# EAGLE design reprap_modular_electronics_master (EAGLE 5.11)
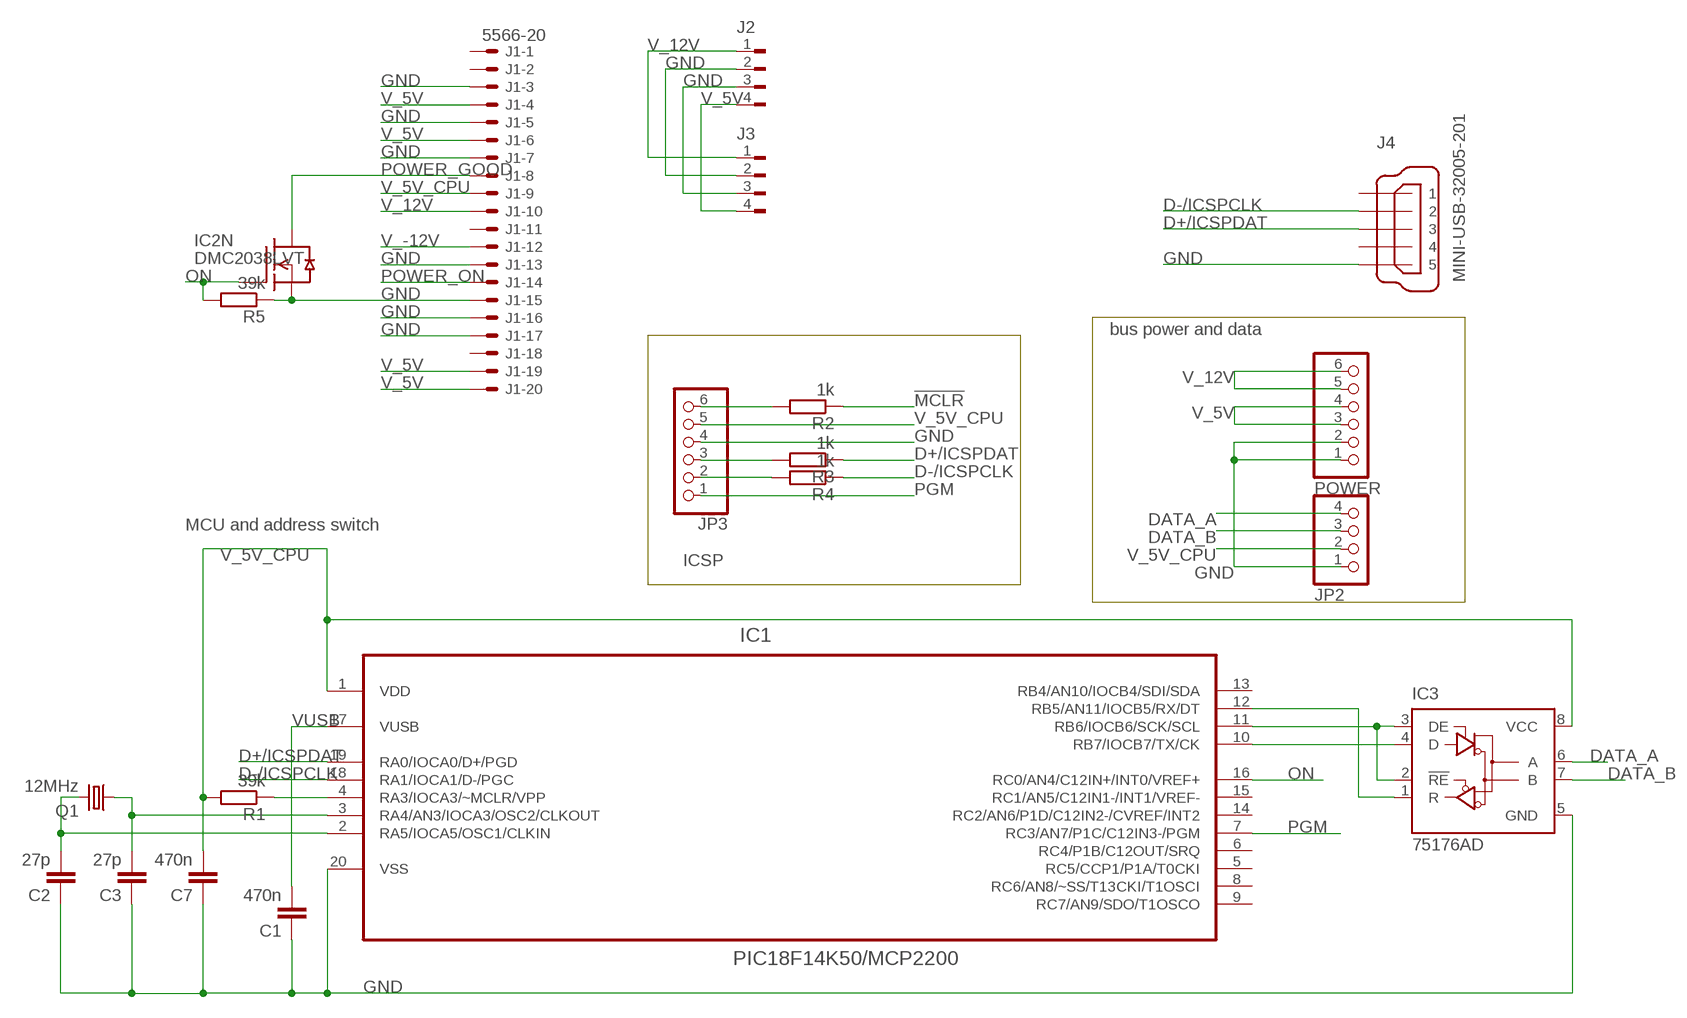
[diagram p0: schematic, sheet 1]

## Parts
C1  470n  C-EUC0603K  [C0603K]
C2  27p  C-EUC0603K  [C0603K]
C3  27p  C-EUC0603K  [C0603K]
C7  470n  C-EUC0603K  [C0603K]
IC1  PIC18F14K50/MCP2200  PIC18F14K50-I/SO  [SOIC127P1030X265-20N]
IC2  DMC2038LVT  [SOT23-6]
IC3  75176AD  [D_R-PDSO-G8]
J1  5566-20  [5566-20]
J2  FLOPPY-4  [FLOPPY-4]
J3  FLOPPY-4  [FLOPPY-4]
J4  MINI-USB-32005-201  [32005-201]
JP2  PINHD-1X4/90  [1X04/90]
JP3  PINHD-1X6/90  [1X06/90]
POWER  PINHD-1X6/90  [1X06/90]
Q1  12MHz  CRYSTALCTS406  [CTS406]
R1  39k  R-EU_R0603  [R0603]
R2  1k  R-EU_R0603  [R0603]
R3  1k  R-EU_R0603  [R0603]
R4  1k  R-EU_R0603  [R0603]
R5  39k  R-EU_R0603  [R0603]

## Nets
!MCLR: IC1.4(RA3/IOCA3/~MCLR/VPP) R1.1 R2.1
D+/ICSPDAT: IC1.19(RA0/IOCA0/D+/PGD) J4.3 R3.1
D-/ICSPCLK: IC1.18(RA1/IOCA1/D-/PGC) J4.2 R4.1
DATA_A: IC3.6(A) JP2.4
DATA_B: IC3.7(B) JP2.3
GND: C1.1 C2.1 C3.1 C7.1 IC1.20(VSS) IC2.5(N:S) IC3.5(GND) J1.3 J1.5 J1.7 J1.13 J1.15 J1.16 J1.17 J2.2 J2.3 J3.2 J3.3 J4.5 JP2.1 JP3.4 POWER.1 POWER.2 R5.1
N$1: C2.2 IC1.2(RA5/IOCA5/OSC1/CLKIN) Q1.3
N$2: C3.2 IC1.3(RA4/AN3/IOCA3/OSC2/CLKOUT) Q1.1
N$3: IC1.12(RB5/AN11/IOCB5/RX/DT) IC3.1(R)
N$4: JP3.3 R3.2
N$5: JP3.2 R4.2
N$6: JP3.6 R2.2
N$7: IC1.11(RB6/IOCB6/SCK/SCL) IC3.2(!RE) IC3.3(DE)
N$8: IC1.10(RB7/IOCB7/TX/CK) IC3.4(D)
ON: IC1.16(RC0/AN4/C12IN+/INT0/VREF+) IC2.1(N:G) R5.2
PGM: IC1.7(RC3/AN7/P1C/C12IN3-/PGM) JP3.1
POWER_GOOD: IC2.6(N:D) J1.8
POWER_ON: J1.14
V_5V: J1.4 J1.6 J1.19 J1.20 J2.4 J3.4 POWER.3 POWER.4
V_5V_CPU: C7.2 IC1.1(VDD) IC3.8(VCC) J1.9 JP2.2 JP3.5 R1.2
V_12V: J1.10 J2.1 J3.1 POWER.5 POWER.6
V_-12V: J1.12
VUSB: C1.2 IC1.17(VUSB)
Unconnected: IC1.5(RC5/CCP1/P1A/T0CKI) IC1.6(RC4/P1B/C12OUT/SRQ) IC1.8(RC6/AN8/~SS/T13CKI/T1OSCI) IC1.9(RC7/AN9/SDO/T1OSCO) IC1.13(RB4/AN10/IOCB4/SDI/SDA) IC1.14(RC2/AN6/P1D/C12IN2-/CVREF/INT2) IC2.2(P:S) IC2.3(P:G) IC2.4(P:D) J1.1 J1.2 J1.11 J1.18 J4.1 J4.4

## Notes on the sheet
- bus power and data
- MCU and address switch
- ICSP

## Power pins joined to a net without a drawn wire
RC1/AN5/C12IN1-/INT1/VREF-: IC1.15(RC1/AN5/C12IN1-/INT1/VREF-)

## Library data of the parts
C1-C3 C7 = rcl:C-EU: CAPACITOR, European symbol
IC1 = ics:PIC18F14K50-I/SO: USB Flash Microcontrollers; DESCRIPTION: Microcontrollers; MPN: PIC18F14K50-I/SO; OC_FARNELL: 1648502; OC_NEWARK: 77M3104; PACKAGE: SOIC-20; SUPPLIER: Microchip
IC2 = ics:DMC2038LVT
IC3 = 751xx:75176A: DIFFERENTIAL BUS TRANSCEIVER Source: http://focus.ti.com/lit/ds/symlink/sn75176a.pdf
J1 = con-molex:5566-20: Mini FIT connector 20 pol ATX PC-Motherboard Power connector Source: http://www.molex.com; OC_FARNELL: unknown; OC_NEWARK: unknown
J2 J3 = con-amp:FLOPPY-4: MATE N-LOCK Floppy / HDD conector Distributor: Bürklin 71F970; OC_FARNELL: unknown; OC_NEWARK: unknown
J4 = con-cypressindustries:MINI-USB-: MINI USB-B Conector Source: www.cypressindustries.com; OC_FARNELL: unknown; OC_NEWARK: unknown
JP2 = pinhead:PINHD-1X4: PIN HEADER
JP3 POWER = pinhead:PINHD-1X6: PIN HEADER
Q1 = crystal:CRYSTAL: CRYSTAL; OC_FARNELL: unknown; OC_NEWARK: unknown
R1-R5 = rcl:R-EU_: RESISTOR, European symbol

## Board
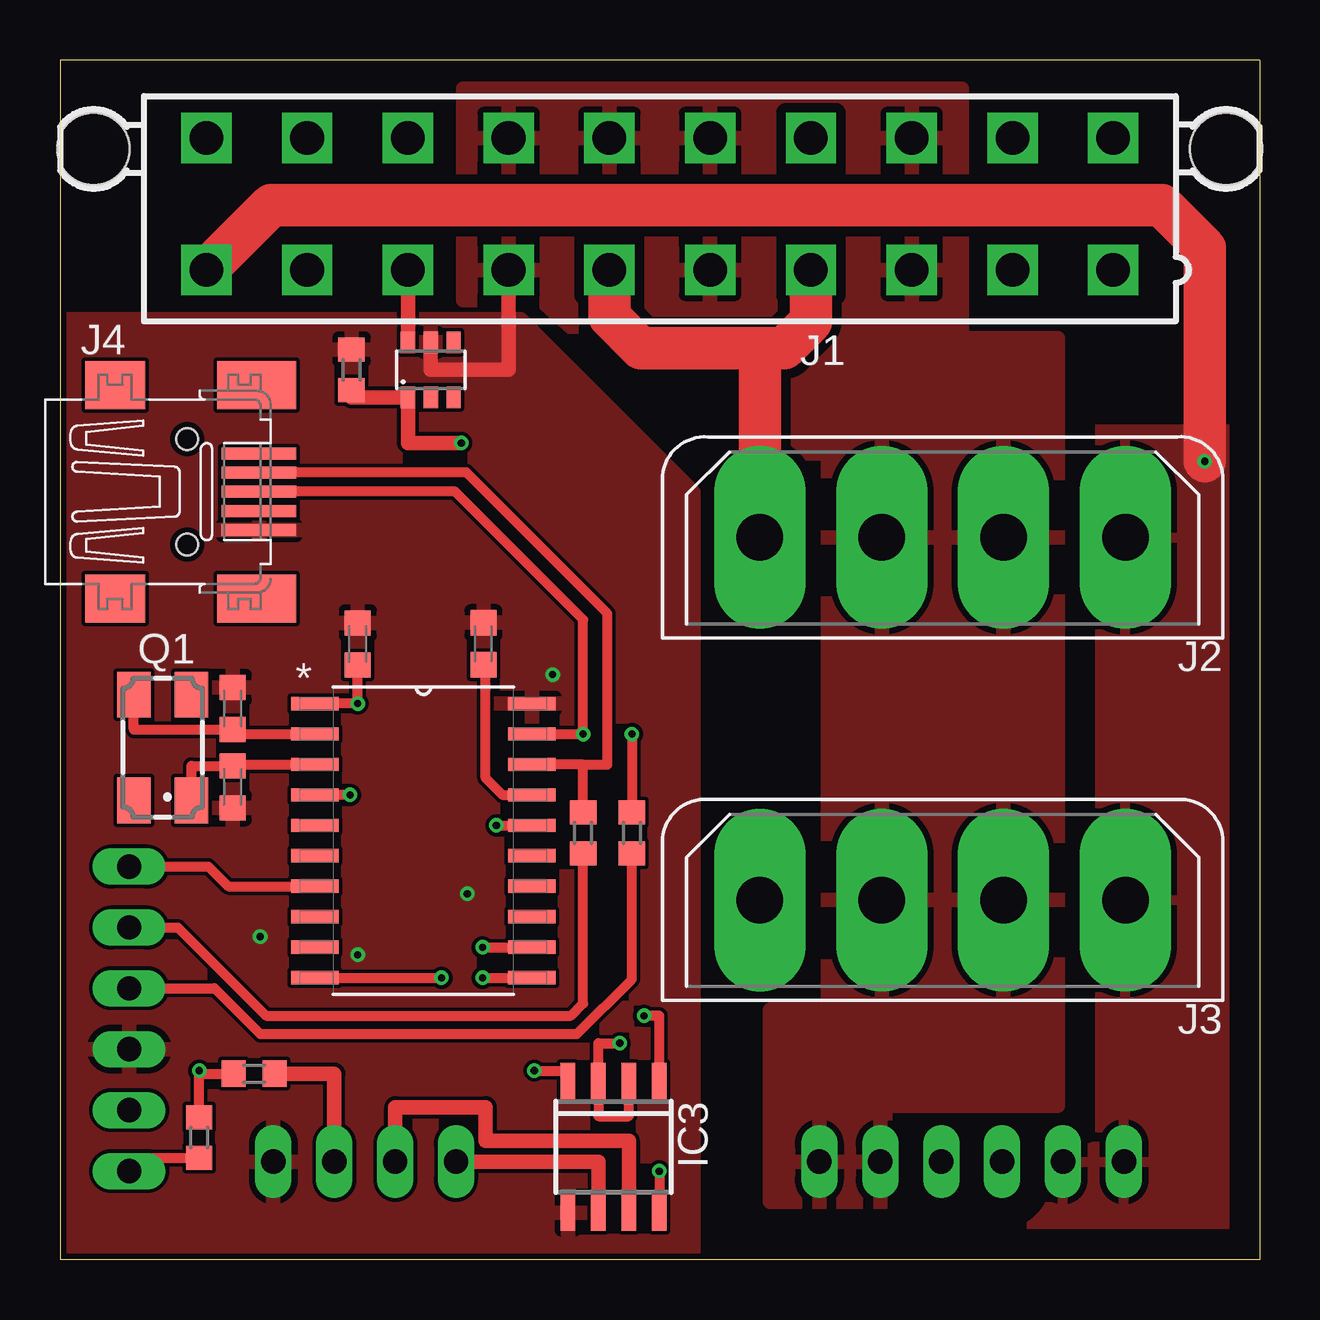
[diagram p1: board, top side]
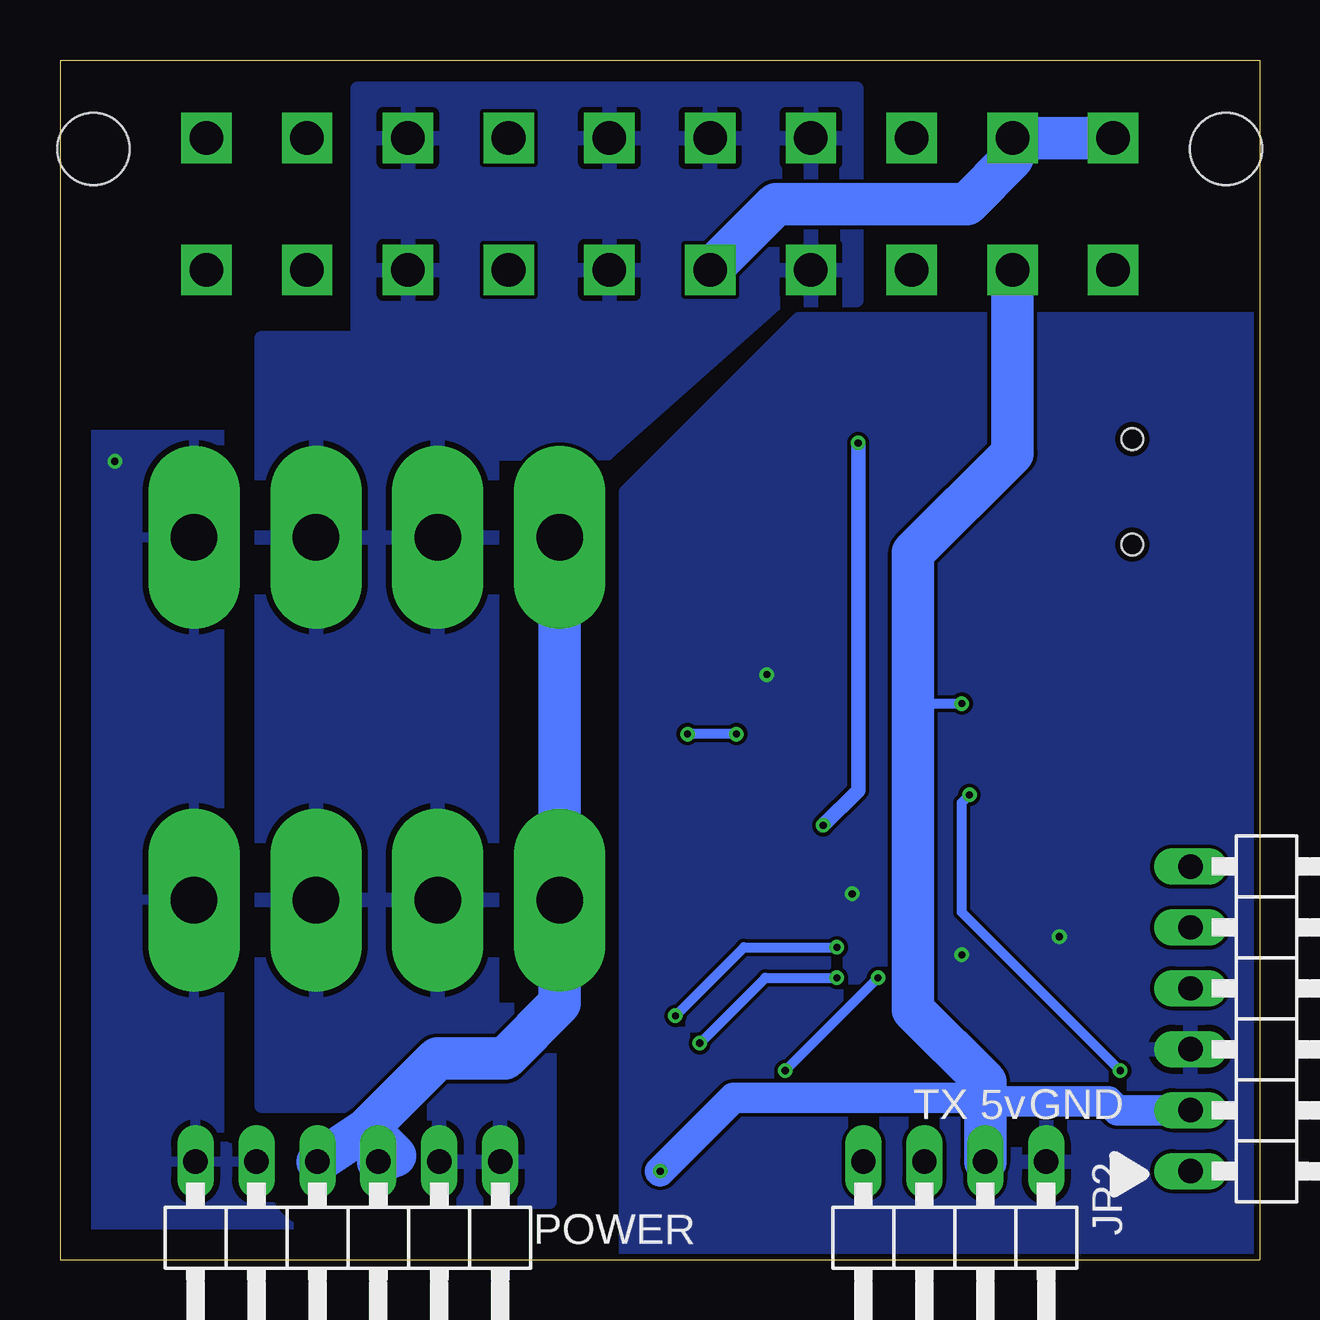
[diagram p2: board, bottom side, seen from below]

Size 50 x 50 mm. Coordinates in mm from the lower left corner, seen from the top.
Outline: 50,0 0,0 0,50 50,50 50,0
Copper layers (1*16): Top 0.035mm / dielectric 1.5mm / Bottom 0.035mm
Design rules "ITead_rule": minimum track width 6mil, minimum drill 0.3mm, track to track 6mil, track to pad 6mil, pad to pad 6mil, via to via 6mil, smd to smd 0mil, copper to edge 10mil, drill to drill 10mil, minimum pad ring 10mil, minimum via ring 6mil, stop-mask expansion 2mil, vias tented up to drill 100mil, thermal gap 10mil

### Footprints (pad centres in the part's own frame; a part is rotated, then mirrored left to right if it is on the bottom)
C0603K = smd 1.05 x 1.08: 1 -0.875,0; 2 0.875,0
SOIC127P1030X265-20N = smd 1.981 x 0.559: 1 -4.521,5.715; 2 -4.521,4.445; 3 -4.521,3.175; 4 -4.521,1.905; 5 -4.521,0.635; 6 -4.521,-0.635; 7 -4.521,-1.905; 8 -4.521,-3.175; 9 -4.521,-4.445; 10 -4.521,-5.715; 11 4.521,-5.715; 12 4.521,-4.445; 13 4.521,-3.175; 14 4.521,-1.905; 15 4.521,-0.635; 16 4.521,0.635; 17 4.521,1.905; 18 4.521,3.175; 19 4.521,4.445; 20 4.521,5.715
SOT23-6 = smd 0.6 x 0.9: 1 -0.95,-1.15; 2 0,-1.15; 3 0.95,-1.15; 4 0.95,1.15; 5 0,1.15; 6 -0.95,1.15
D_R-PDSO-G8 = smd 0.6 x 1.5: 1 -1.905,-2.75; 2 -0.635,-2.75; 3 0.635,-2.75; 4 1.905,-2.75; 5 1.905,2.75; 6 0.635,2.75; 7 -0.635,2.75; 8 -1.905,2.75
5566-20 = drill 1.4 square: 1 18.9,-2.75; 2 14.7,-2.75; 3 10.5,-2.75; 4 6.3,-2.75; 5 2.1,-2.75; 6 -2.1,-2.75; 7 -6.3,-2.75; 8 -10.5,-2.75; 9 -14.7,-2.75; 10 -18.9,-2.75; 11 18.9,2.75; 12 14.7,2.75; 13 10.5,2.75; 14 6.3,2.75; 15 2.1,2.75; 16 -2.1,2.75; 17 -6.3,2.75; 18 -10.5,2.75; 19 -14.7,2.75; 20 -18.9,2.75 | hole 3: 23.6,2.29; -23.6,2.29
FLOPPY-4 = drill 1.93 pad 3.81 long: 1 7.62,0; 2 2.54,0; 3 -2.54,0; 4 -7.62,0
32005-201 = smd 3.1 x 0.5: 1 3,1.6; 2 3,0.8; 3 3,0; 4 3,-0.8; 5 3,-1.6 | smd 2.5 x 2: M1 -3,-4.45; M2 -3,4.45 | smd 3.3 x 2: M3 2.9,4.45; M4 2.9,-4.45 | hole 0.9: 0,2.2; 0,-2.2
1X04/90 = drill 1.016 long: 1 -3.81,-3.81; 2 -1.27,-3.81; 3 1.27,-3.81; 4 3.81,-3.81
1X06/90 = drill 1.016 long: 1 -6.35,-3.81; 2 -3.81,-3.81; 3 -1.27,-3.81; 4 1.27,-3.81; 5 3.81,-3.81; 6 6.35,-3.81
CTS406 = smd 1.9 x 1.4: 1 -2.2,-1.2; 2 2.2,-1.2; 3 2.2,1.2; 4 -2.2,1.2
R0603 = smd 1 x 1.1: 1 -0.85,0; 2 0.85,0

### Placement (x,y rotation side)
C1  17.65,25.67 270 top
C2  7.2,22.97 270 top
C3  7.2,19.7 90 top
C7  12.41,25.65 270 top
IC1  15.15,17.46 0 top
IC2  15.46,37.08 0 top
IC3  23.08,4.7 180 top
J1  25,44 0 top
J2  36.79,30.1 0 top
J3  36.79,14.99 0 top
J4  5.3,32 0 top
JP2  12.7,0.27 180 bottom
JP3  -0.93,10.03 270 bottom
POWER  38,0.27 180 bottom
Q1  4.28,21.34 90 top
R1  8.09,7.75 0 top
R2  5.8,5.08 270 top
R3  23.84,17.78 270 top
R4  21.81,17.78 270 top
R5  12.15,37.08 270 top

### Tracks (layer width: path | path; a pad name or v marks a point on that pad's centre or on a via)
!MCLR  (via drill 0.3)
  Top 0.406: 5.8,7.75 R1.1 | R2.1 5.8,7.75 | v12.09,19.36 IC1.4 | 5.8,7.75 v5.8,7.87
  Bottom 0.406: v12.09,19.36 12.41,19.05 12.41,14.48 v5.8,7.87
D+/ICSPDAT  (via drill 0.3)
  Top 0.406: IC1.19 v21.81,21.91 21.81,26.67 16.47,32 J4.3 | v23.84,21.91 R3.1
  Bottom 0.406: v21.81,21.91 v23.84,21.91
D-/ICSPCLK
  Top 0.406: 21.81,20.64 22.82,20.64 22.82,26.92 16.94,32.8 J4.2 | 21.81,20.64 IC1.18 | R4.1 21.81,20.64
DATA_A
  Top 0.61: IC3.6 22.44,4.06 16.51,4.06 JP2.4
DATA_B
  Top 0.61: IC3.7 23.71,4.95 17.74,4.95 17.74,6.35 13.97,6.35 JP2.3
GND  (via drill 0.3)
  Top 0.61: IC2.5 15.46,37.08 18.7,37.08 J1.7
  other vias: 20.54,24.38 12.41,12.7 8.34,13.46 16.98,15.24
  pour Top (isolate 0.406): 16.8,48.8 16.8,40 20,40 27.2,33.6 32,33.6 32,10.4 29.6,10.4 29.6,2.4 34.4,2.4 34.4,6.4 41.6,6.4 41.6,38.4 37.6,38.4 37.6,48.8
  pour Bottom: 16.8,48.8 16.8,40 20,40 27.2,33.6 32,33.6 32,10.4 29.6,10.4 29.6,2.4 34.4,2.4 34.4,6.4 41.6,6.4 41.6,38.4 37.6,38.4 37.6,48.8
  pour Top: 0,0 26.4,0 26.4,32 19.2,39.2 0,39.2
  pour Bottom: 0,0 26.4,0 26.4,32 19.2,39.2 0,39.2
N$1
  Top 0.406: Q1.3 3.08,22.09 C2.2 7.2,21.91 IC1.2
N$2
  Top 0.406: Q1.1 5.48,20.58 C3.2 7.2,20.64 IC1.3
N$3  (via drill 0.3)
  Top 0.406: IC3.1 24.98,10.16 v24.35,10.16 | v17.61,13.02 IC1.12
  Bottom 0.406: v24.35,10.16 21.49,13.02 v17.61,13.02
N$4
  Top 0.406: JP3.3 6.44,11.3 8.34,9.4 21.55,9.4 23.84,11.68 R3.2
N$5
  Top 0.406: JP3.2 4.92,13.84 8.6,10.16 21.3,10.16 21.81,10.67 R4.2
N$6
  Top 0.406: JP3.6 2.88,4.23 R2.2
N$7  (via drill 0.3)
  Top 0.406: IC3.2 23.71,5.97 22.44,5.97 IC3.3 22.44,9.02 v23.33,9.02 | v17.61,11.74 IC1.11
  Bottom 0.406: v23.33,9.02 20.6,11.74 v17.61,11.74
N$8  (via drill 0.3)
  Top 0.406: IC3.4 21.17,7.87 v19.77,7.87 | IC1.10 v15.9,11.74
  Bottom 0.406: v15.9,11.74 v19.77,7.87
ON  (via drill 0.3)
  Top 0.406: v18.19,18.09 IC1.16
  Top 0.61: R5.2 12.15,35.93 IC2.1 14.51,34.04 v16.73,34.04
  Bottom 0.61: v16.73,34.04 16.73,19.56 v18.19,18.09
PGM
  Top 0.406: JP3.1 6.18,16.38 7.01,15.55 IC1.7
POWER_GOOD
  Top 0.61: J1.8 IC2.6
V_5V
  Top 1.778: J1.4 31.3,39.1 30.2,38 29.2,38 | J1.6 22.9,39.3 24.2,38 29.2,38 | J2.4 29.17,37.97 29.2,38
  Bottom 1.778: J2.4 J3.4 29.17,10.67 31.46,8.38 34.27,8.38 37.18,5.47 | 37.18,5.47 POWER.4 | POWER.3 36.03,4.32 37.18,5.47 | J1.20 J1.19 10.3,45.9 12.2,44 20.15,44 J1.6
V_5V_CPU  (via drill 0.3)
  Top 0.406: IC1.1 v12.41,23.18 C7.2 | v24.98,3.68 IC3.8
  Top 0.61: R1.2 11.43,7.75 JP2.2
  Bottom 0.406: v12.41,23.18 14.69,23.18 14.44,23.37
  Bottom 1.27: JP3.5 5.93,6.22 6.31,6.6 11.43,6.6 11.43,6.73 21.93,6.73 v24.98,3.68
  Bottom 1.778: J1.9 10.3,33.6 14.44,29.46 14.44,23.37 14.44,10.41 11.43,7.4 11.43,6.73 JP2.2
V_12V  (via drill 0.3)
  Top 1.778: J1.10 8.79,43.94 45.94,43.94 47.71,42.16 v47.71,33.27
  pour Top (isolate 1.27, rank 2): 42.07,34.62 49.87,34.62 50,0 40.2,0 40.2,10 42.2,12
  pour Bottom (isolate 1.27, rank 2): 42.2,34.36 50,34.36 50,0 40.2,0 40.2,10 42.2,12
VUSB
  Top 0.406: IC1.17 18.44,19.36 17.74,20.07 17.74,24.79 C1.2

### Text on the board
bNames: GND | 5v | TX